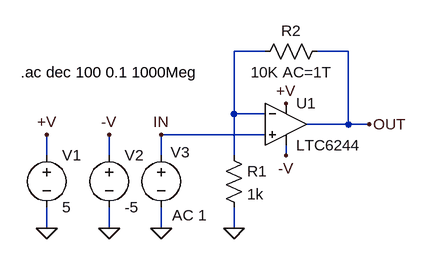
[diagram p0: schematic Fig_8-8_LTC6244_AC_Open.asc]
Fig_8-8_LTC6244_AC_Open.asc, the LTspice schematic file:
Version 4
SHEET 1 880 680
WIRE 304 240 256 240
WIRE 432 240 384 240
WIRE 256 336 256 240
WIRE 304 336 256 336
WIRE 432 352 432 240
WIRE 432 352 368 352
WIRE 464 352 432 352
WIRE 304 368 144 368
WIRE -32 400 -32 368
WIRE 64 400 64 368
WIRE 144 400 144 368
WIRE 256 400 256 336
WIRE 336 400 336 384
WIRE -32 512 -32 480
WIRE 64 512 64 480
WIRE 144 512 144 480
WIRE 256 512 256 480
FLAG -32 512 0
FLAG 64 512 0
FLAG -32 368 +V
FLAG 144 512 0
FLAG 144 368 IN
FLAG 464 352 OUT
FLAG 336 320 +V
FLAG 64 368 -V
FLAG 336 400 -V
FLAG 256 512 0
SYMBOL voltage -32 384 R0
SYMATTR InstName V1
SYMATTR Value 5
SYMBOL voltage 64 384 R0
SYMATTR InstName V2
SYMATTR Value -5
SYMBOL LTC6244 336 352 R0
SYMATTR InstName U1
SYMBOL voltage 144 384 R0
WINDOW 0 15 11 Left 2
WINDOW 3 11 105 Left 2
WINDOW 123 17 108 Left 2
WINDOW 39 0 0 Left 2
SYMATTR InstName V3
SYMATTR Value ""
SYMATTR Value2 AC 1
SYMBOL res 240 384 R0
SYMATTR InstName R1
SYMATTR Value 1k
SYMBOL res 288 256 R270
WINDOW 0 32 56 VTop 2
WINDOW 3 0 56 VBottom 2
SYMATTR InstName R2
SYMATTR Value 10K AC=1T
TEXT -72 272 Left 2 !.ac dec 100 0.1 1000Meg

The netlist it stands for:
* Fig_8-8_LTC6244_AC_Open.asc
V1 +V 0 5
V2 -V 0 -5
XU1 IN N001 +V -V OUT LTC6244  ; pins In+ In- V+ V- OUT
V3 IN 0 AC 1
R1 N001 0 1k
R2 N001 OUT 10K AC=1T
.ac dec 100 0.1 1000Meg
.backanno
.end